# Altium project DualMetroPrototyp.PrjPcb
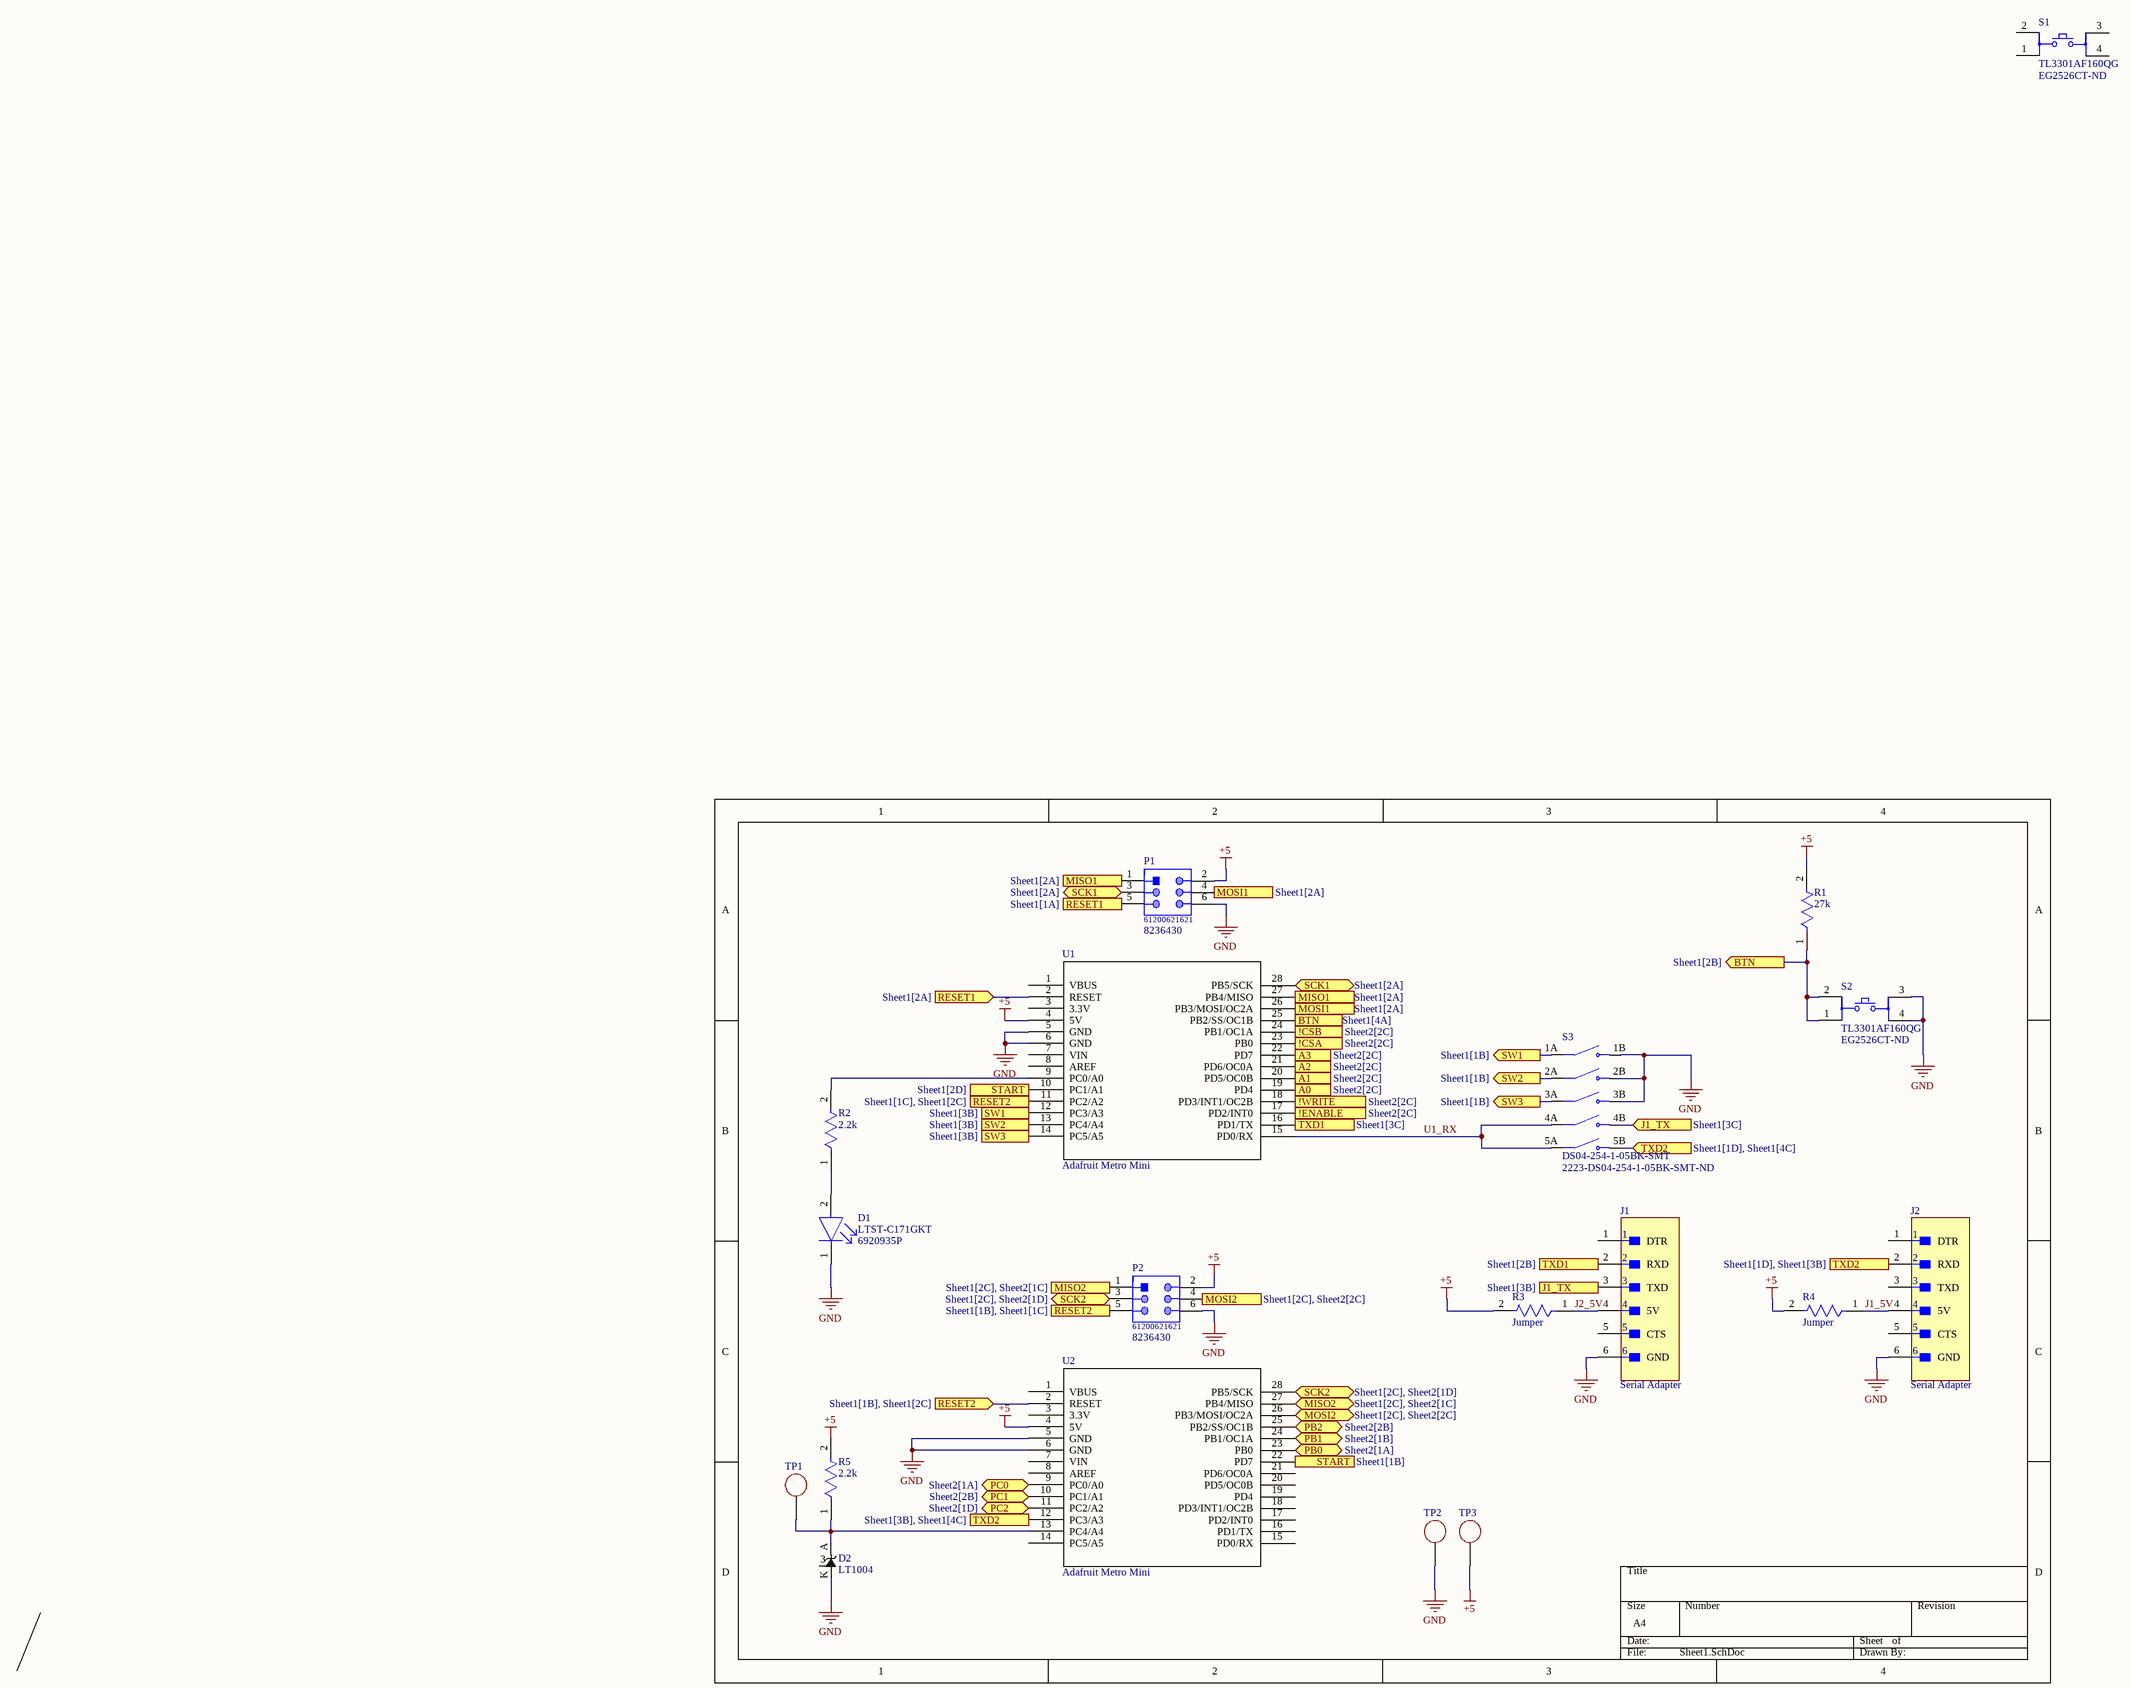
[diagram p0: Sheet1.SchDoc]
2 sheets, 28 parts. Net scope: flat (ports and power ports of the same name join across sheets).
Board file: DualMetroPrototyp.PcbDoc
Sheets:
  Sheet1.SchDoc
  Sheet2.SchDoc

## Sheet Sheet1.SchDoc
size A4; SheetNumber: 1; SheetTotal: 2

### Parts
D1  LTST-C171GKT  Supplier Part Number 1: 6920935P  [FP-LTST-C171GKT-MFG]
D2  LT1004  [LT1004CZ]  (no BOM)
J1  Serial Adapter  [FP-22-28-4060-MFG]
J2  Serial Adapter  [FP-22-28-4060-MFG]
P1  61200621621  Supplier Part Number 1: 8236430  [61200621621]
P2  61200621621  Supplier Part Number 1: 8236430  [61200621621]
R1  27k  [FP-RMCF0805-IPC_B]
R2  2.2k  [FP-RMCF0805-IPC_B]
R3  Jumper  [FP-RMCF0805-IPC_B]  (no BOM)
R4  Jumper  [FP-RMCF0805-IPC_B]  (no BOM)
R5  2.2k  [FP-RMCF0805-IPC_B]
S1  TL3301AF160QG  Supplier Part Number 1: EG2526CT-ND  [FP-TL3301AF160QG-MFG]
S2  TL3301AF160QG  Supplier Part Number 1: EG2526CT-ND  [FP-TL3301AF160QG-MFG]
S3  DS04-254-1-05BK-SMT  Supplier Part Number 1: 2223-DS04-254-1-05BK-SMT-ND  [SW_DS04-254-1-05BK-SMT]
TP1  61300111121  [61300111121]  (value not drawn)  (no BOM)
TP2  61300111121  [61300111121]  (value not drawn)  (no BOM)
TP3  61300111121  [61300111121]  (value not drawn)  (no BOM)
U1  Adafruit Metro Mini  [Adafruit Metro Mini]  (no BOM)
U2  Adafruit Metro Mini  [Adafruit Metro Mini]  (no BOM)

### Ports
!CSA (out, see Sheet2[2C]), !CSB (out, see Sheet2[2C]), !ENABLE (out, see Sheet2[2C]), !WRITE (out, see Sheet2[2C]), A0 (out, see Sheet2[2C]), A1 (out, see Sheet2[2C]), A2 (out, see Sheet2[2C]), A3 (out, see Sheet2[2C]), BTN (in, see Sheet1[4A]), BTN (out, see Sheet1[2B]), J1_TX (in, see Sheet1[3C]), J1_TX (out, see Sheet1[3B]), MISO1 (in, see Sheet1[2A]), MISO1 (out, see Sheet1[2A]), MISO2 (bidir, see Sheet1[2C], Sheet2[1C]), MISO2 (in, see Sheet1[2C], Sheet2[1C]), MOSI1 (in, see Sheet1[2A]), MOSI1 (out, see Sheet1[2A]), MOSI2 (bidir, see Sheet1[2C], Sheet2[2C]), MOSI2 (out, see Sheet1[2C], Sheet2[2C]), PB0 (bidir, see Sheet2[1A]), PB1 (bidir, see Sheet2[1B]), PB2 (bidir, see Sheet2[2B]), PC0 (bidir, see Sheet2[1A]), PC1 (bidir, see Sheet2[2B]), PC2 (bidir, see Sheet2[1D]), RESET1 (in, see Sheet1[2A]), RESET1 (out, see Sheet1[1A]), RESET2 (in, see Sheet1[1B], Sheet1[2C]), RESET2 (out, see Sheet1[1B], Sheet1[1C]), RESET2 (out, see Sheet1[1C], Sheet1[2C]), SCK1 (bidir, see Sheet1[2A]), SCK2 (bidir, see Sheet1[2C], Sheet2[1D]), START (in, see Sheet1[1B]), START (out, see Sheet1[2D]), SW1 (in, see Sheet1[3B]), SW1 (out, see Sheet1[1B]), SW2 (in, see Sheet1[3B]), SW2 (out, see Sheet1[1B]), SW3 (in, see Sheet1[3B]), SW3 (out, see Sheet1[1B]), TXD1 (in, see Sheet1[2B]), TXD1 (out, see Sheet1[3C]), TXD2 (in, see Sheet1[1D], Sheet1[3B]), TXD2 (in, see Sheet1[1D], Sheet1[4C]), TXD2 (out, see Sheet1[3B], Sheet1[4C])

### Nets
+5: P1.2(5V) P2.2(5V) R1.2 R3.2 R4.2 R5.2 TP3.1 U1.4(5V) U2.4(5V)
GND: D1.1(C) D2.K(Kathode) J1.6(GND) J2.6(GND) P1.6(GND) P2.6(GND) S2.3 S2.4 S3.1B(NO1) S3.2B(NO2) S3.3B(NO3) TP2.1 U1.5(GND) U1.6(GND) U2.5(GND) U2.6(GND)
!CSA: U1.23(PB0) ; port !CSA
!CSB: U1.24(PB1/OC1A) ; port !CSB
!ENABLE: U1.17(PD2/INT0) ; port !ENABLE
!WRITE: U1.18(PD3/INT1/OC2B) ; port !WRITE
A0: U1.19(PD4) ; port A0
A1: U1.20(PD5/OC0B) ; port A1
A2: U1.21(PD6/OC0A) ; port A2
A3: U1.22(PD7) ; port A3
BTN: R1.1 S2.1 S2.2 U1.25(PB2/SS/OC1B) ; port BTN
J1_5V: J2.4(5V) R4.1
J1_TX: J1.3(TXD) S3.4B(NO4) ; port J1_TX
J2_5V: J1.4(5V) R3.1
MISO1: P1.1(MISO) U1.27(PB4/MISO) ; port MISO1
MISO2: P2.1(MISO) U2.27(PB4/MISO) ; port MISO2
MOSI1: P1.4(MOSI) U1.26(PB3/MOSI/OC2A) ; port MOSI1
MOSI2: P2.4(MOSI) U2.26(PB3/MOSI/OC2A) ; port MOSI2
PB0: U2.23(PB0) ; port PB0
PB1: U2.24(PB1/OC1A) ; port PB1
PB2: U2.25(PB2/SS/OC1B) ; port PB2
Probe1: U2.9(PC0/A0) ; port PC0
Probe2: U2.10(PC1/A1) ; port PC1
Probe3: U2.11(PC2/A2) ; port PC2
RESET1: P1.5(RESET) U1.2(RESET) ; port RESET1
RESET2: P2.5(RESET) U1.11(PC2/A2) U2.2(RESET) ; port RESET2
SCK1: P1.3(SCK) U1.28(PB5/SCK) ; port SCK1
SCK2: P2.3(SCK) U2.28(PB5/SCK) ; port SCK2
START: U1.10(PC1/A1) U2.22(PD7) ; port START
SW1: S3.1A(COM1) U1.12(PC3/A3) ; port SW1
SW2: S3.2A(COM2) U1.13(PC4/A4) ; port SW2
SW3: S3.3A(COM3) U1.14(PC5/A5) ; port SW3
TXD1: J1.2(RXD) U1.16(PD1/TX) ; port TXD1
TXD2: J2.2(RXD) S3.5B(NO5) U2.12(PC3/A3) ; port TXD2
U1_RX: S3.4A(COM4) S3.5A(COM5) U1.15(PD0/RX)
NetD1_2: D1.2(A) R2.1
NetD2_A: D2.A(Anode) R5.1 TP1.1 U2.13(PC4/A4)
NetR2_2: R2.2 U1.9(PC0/A0)

Not connected (* = marked no-connect by the designer): D2 3; J1 1(DTR) 5(CTS); J2 1(DTR) 3(TXD) 5(CTS); S1 1 2 3 4; U1 1(VBUS) 3(3.3V) 7(VIN) 8(AREF); U2 1(VBUS) 3(3.3V) 7(VIN) 8(AREF) 14(PC5/A5) 15(PD0/RX) 16(PD1/TX) 17(PD2/INT0) 18(PD3/INT1/OC2B) 19(PD4) 20(PD5/OC0B) 21(PD6/OC0A)

### Library data of the parts
D1 = CMP-22017-000007-1: LED GREEN CLEAR CHIP SMD; Luminous Intensity: 12mcd; Lens Color: Colorless; Dominant Wavelength: 569nm; Number of LEDs: 1; Power Dissipation: 100mW; Viewing Angle: 130°; Reverse Voltage: 5V; Test Current: 10mA; Forward Voltage: 2.1V; Wavelength: 585nm; Lens Style: Diffused; Forward Current: 30mA; Height: 0.8mm; Mount: Surface Mount; Package Quantity: 1; Length: 2mm; Case Code (Metric): 2012; Number of Pins: 2; Number of Elements: 1; Packaging: Tape and Reel; Color: Green; Min Operating Temperature: -55°C; Case/Package: 0805; Power Rating: 100mW; Max Operating Temperature: 85°C; Radiation Hardening: No; Depth: 1.25mm; Lens Transparency: Clear; Width: 1.25mm; Lead Free: Lead Free; Case Code (Imperial): 0805; Illumination Color: Green; Supplier 1: Rs
D2 = LT1004: pin to pad: 3>1 Â1>2
J1 J2 = CMP-04776-000763-1: CONN HEADER VERT 6POS 2.54MM; Voltage Rating: 250V; Current Rating: 4A; Number of Contacts: 6; Max Voltage Rating (DC): 250.25kV; Gender: Male; Contact Resistance: 20mR; Connector Type: Male Pin; Color: Black; Max Voltage Rating (AC): 250V; Pitch: 2.54mm; Orientation: Straight; Max Operating Temperature: 75°C; Contact Plating: Tin; Depth: 2.49mm; Contact Type: Male Pin; Number of Positions: 6; Length: 15.24mm; Packaging: Bulk; Mount: Through Hole; Housing Material: Thermoplastic; Housing Color: Black; Termination: Solder; Contact Material: Brass; Min Operating Temperature: 0°C; Series: KK® 42375; Number of Rows: 1; Package Quantity: 1; RoHS Compliant: Yes; Contact Mating Length: 0.24inch
P1 P2 = CMP-1502-00000-1: Male Box Header WR-BHD, THT, Vertical, pitch 2.54 mm, 6 pins; Manufacturer: Wurth Elektronik; Withstanding Voltage: 500VAC; Working Voltage: 250VAC; Pin Number: 6; Pitch: 2.54mm; Contact Resistance: 20mOhm; Part Number: 61200621621; Manufacturer URL: http://www.we-online.de; Published Date: August2018; Orientation: Vertical; Publisher: WurthElektronik; Operating Temperature: -40to125degC; Datasheet URL: https://katalog.we-online.de/em/datasheet/6120xx21621.pdf; Mounting Technology: THT; Packaging: Tray; Gender: Male; Package Reference: 61200621621; Supplier 1: Rs
R1-R5 = CMP-26527-000017-1: RES 0 OHM JUMPER 1/8W 0805; Power Rating: 125mW; Resistance: 0mR; Depth: 1.25mm; Length: 2mm; Military Standard: Not; Width: 0.049inch; Case Code (Imperial): 0805; Number of Terminations: 2; Mount: Surface Mount; Contact Plating: Tin; Height: 0.026inch; Case/Package: 0805; Min Operating Temperature: -55°C; Composition: Thick Film; Max Operating Temperature: 155°C; Packaging: Tape and Reel; Features: Automotive AEC-Q200; Max Power Dissipation: 125mW; Radiation Hardening: No; Lead Free: Lead Free; Case Code (Metric): 2012
S1 S2 = TL3301AF160QG: Keypad Switch, 1 Switches, SPST, Momentary-tactile, 0.05A, 50VDC, 2.06N, Solder Terminal, Surface Mount-straight12V; Actuator Type: Standard; Current Rating: 50mA; Contact Resistance: 100mR; Max Voltage Rating (DC): 50V; Voltage Rating (DC): 12V; Actuator Length: 1.4mm; Electrical Life: 100000Cycles; Switch Travel: 0.25mm; Operating Force: 160gf; Switch Function: Off-Mom; Actuator Material: Nylon; Illumination Type: Non-Illuminated; Orientation: Straight; Lead Free: Lead Free; Contact Material: Silver; Series: TL3301; Mount: Surface Mount; Voltage Rating: 50V; REACH SVHC: No SVHC; Packaging: Tape and Reel; Termination: Gull Wing; RoHS Compliant: Yes; Throw Configuration: SPST; Min Operating Temperature: -20°C; Package Quantity: 1000; Mechanical Life: 100000Cycles; Contact Plating: Silver; Max Operating Temperature: 70°C; Insulation Resistance: 100MR; Supplier 1: Digi-Key
TP1-TP3 = Testpoint: THT Vertical Pin Header WR-PHD, Pitch 2.54 mm, Single Row, 1 pins; Manufacturer: Wurth Elektronik; Gender: Male; Working Voltage: 250VAC; Withstanding Voltage: 500VAC; Pin Number: 1; Contact Resistance: 20mOhm; Rated Current: 3A; Pitch: 2.54mm; Mounting Technology: THT; Datasheet URL: https://katalog.we-online.de/em/datasheet/6130xx11121.pdf; Manufacturer URL: http://www.we-online.de; Operating Temperature: -40to105degC; Publisher: WurthElektronik; Part Number: 61300111121; Row Number: Single; Package Reference: 61300111121; Orientation: Vertical; Packaging: Bag
S3 = DS04-254-1-05BK-SMT: Availability: Unavailable; Price: None; Package: None; Value: *; MP: DS04-254-1-05BK-SMT; Supplier 1: Digi-Key

## Sheet Sheet2.SchDoc
size A4; SheetNumber: 2; SheetTotal: 2
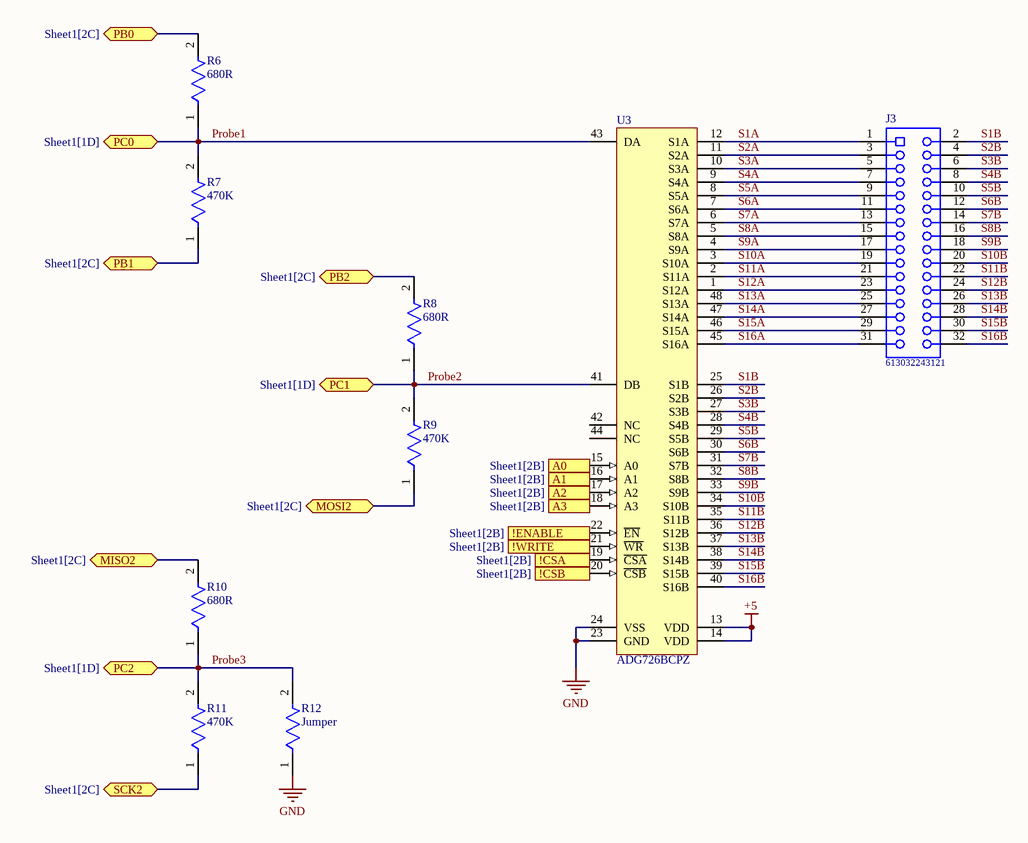
[diagram p1: Sheet2.SchDoc]

### Parts
J3  613032243121  [613032243121]
R6  680R  [FP-RMCF0805-IPC_B]  (no BOM)
R7  470K  [FP-RMCF0805-IPC_B]  (no BOM)
R8  680R  [FP-RMCF0805-IPC_B]  (no BOM)
R9  470K  [FP-RMCF0805-IPC_B]  (no BOM)
R10  680R  [FP-RMCF0805-IPC_B]  (no BOM)
R11  470K  [FP-RMCF0805-IPC_B]  (no BOM)
R12  Jumper  [FP-RMCF0805-IPC_B]  (no BOM)
U3  ADG726BCPZ  [ADG726 Breakout]  (no BOM)

### Ports
!CSA (in, see Sheet1[2B]), !CSB (in, see Sheet1[2B]), !ENABLE (in, see Sheet1[2B]), !WRITE (in, see Sheet1[2B]), A0 (in, see Sheet1[2B]), A1 (in, see Sheet1[2B]), A2 (in, see Sheet1[2B]), A3 (in, see Sheet1[2B]), MISO2 (bidir, see Sheet1[2C]), MOSI2 (bidir, see Sheet1[2C]), PB0 (bidir, see Sheet1[2C]), PB1 (bidir, see Sheet1[2C]), PB2 (bidir, see Sheet1[2C]), PC0 (bidir, see Sheet1[1D]), PC1 (bidir, see Sheet1[1D]), PC2 (bidir, see Sheet1[1D]), SCK2 (bidir, see Sheet1[2C])

### Nets
+5: U3.13(VDD) U3.14(VDD)
GND: R12.1 U3.23(GND) U3.24(VSS)
!CSA: U3.19(~{CSA}) ; port !CSA
!CSB: U3.20(~{CSB}) ; port !CSB
!ENABLE: U3.22(~{EN}) ; port !ENABLE
!WRITE: U3.21(~{WR}) ; port !WRITE
A0: U3.15(A0) ; port A0
A1: U3.16(A1) ; port A1
A2: U3.17(A2) ; port A2
A3: U3.18(A3) ; port A3
MISO2: R10.2 ; port MISO2
MOSI2: R9.1 ; port MOSI2
PB0: R6.2 ; port PB0
PB1: R7.1 ; port PB1
PB2: R8.2 ; port PB2
Probe1: R6.1 R7.2 U3.43(DA) ; port PC0
Probe2: R8.1 R9.2 U3.41(DB) ; port PC1
Probe3: R10.1 R11.2 R12.2 ; port PC2
S1A: J3.1 U3.12(S1A)
S1B: J3.2 U3.25(S1B)
S2A: J3.3 U3.11(S2A)
S2B: J3.4 U3.26(S2B)
S3A: J3.5 U3.10(S3A)
S3B: J3.6 U3.27(S3B)
S4A: J3.7 U3.9(S4A)
S4B: J3.8 U3.28(S4B)
S5A: J3.9 U3.8(S5A)
S5B: J3.10 U3.29(S5B)
S6A: J3.11 U3.7(S6A)
S6B: J3.12 U3.30(S6B)
S7A: J3.13 U3.6(S7A)
S7B: J3.14 U3.31(S7B)
S8A: J3.15 U3.5(S8A)
S8B: J3.16 U3.32(S8B)
S9A: J3.17 U3.4(S9A)
S9B: J3.18 U3.33(S9B)
S10A: J3.19 U3.3(S10A)
S10B: J3.20 U3.34(S10B)
S11A: J3.21 U3.2(S11A)
S11B: J3.22 U3.35(S11B)
S12A: J3.23 U3.1(S12A)
S12B: J3.24 U3.36(S12B)
S13A: J3.25 U3.48(S13A)
S13B: J3.26 U3.37(S13B)
S14A: J3.27 U3.47(S14A)
S14B: J3.28 U3.38(S14B)
S15A: J3.29 U3.46(S15A)
S15B: J3.30 U3.39(S15B)
S16A: J3.31 U3.45(S16A)
S16B: J3.32 U3.40(S16B)
SCK2: R11.1 ; port SCK2

Not connected (* = marked no-connect by the designer): U3 42(NC) 44(NC)

### Library data of the parts
J3 = CMP-1502-01445-1: THT Angled Socket Header WR-PHD, Pitch 2.54 mm, Dual Row, 32 pins; Manufacturer: Wurth Elektronik; Pitch: 2.54mm; Contact Resistance: 20mOhm; Gender: Female; Withstanding Voltage: 500VAC; Rated Current: 3A; Working Voltage: 250VAC; Pin Number: 32; Publisher: WurthElektronik; Part Number: 613032243121; Manufacturer URL: http://www.we-online.de; Package Reference: 613032243121; Operating Temperature: -40to125degC; Mounting Technology: THT; Packaging: Tray; Datasheet URL: https://katalog.we-online.de/em/datasheet/6130xx243121.pdf; Row Number: Dual; Orientation: Angled
R6-R12 = CMP-26527-000017-1: as R1 on sheet Sheet1; Depth: 1.25mm; Length: 2mm; Military Standard: Not; Width: 0.049inch; Case Code (Imperial): 0805; Number of Terminations: 2; Mount: Surface Mount; Contact Plating: Tin; Height: 0.026inch; Case/Package: 0805; Min Operating Temperature: -55°C; Composition: Thick Film; Max Operating Temperature: 155°C; Packaging: Tape and Reel; Features: Automotive AEC-Q200; Max Power Dissipation: 125mW; Radiation Hardening: No; Lead Free: Lead Free; Case Code (Metric): 2012
U3 = CMP-0798-00018-1: 1.8 to 5.5 V / +/-2.5 V, 4 Ohm, 16-Channel Analog Multiplexer, -40 to 85 degC, 48-pin QFN (CP-48-1), Tray; Manufacturer: Analog Devices; Ron (ohms): 4; Supply V Guar Performance: Dual_(+/-2.5V), Single_(+3V), Single_(+5V); Bandwidth (Hz): 34M; Max Analog Signal Range: Vss to Vdd; t transition (s): 23n; PackageDescription: 48-Pin Lead Frame Chip Scale Package, Body 7 x 7 mm, Pitch 0.5 mm; ComponentLink3URL: http:/www.analog.com/static/imported-files/packages/PKG_PDF/LFCSP(CP)/CP-48/CP_48_1.pdf; Code_JEDEC: MO-220-VKKD-2; ComponentLink2Description: Datasheet; PackageReference: CP-48-1; ComponentLink2URL: http://www.analog.com/static/imported-files/data_sheets/ADG726_732.pdf; DatasheetVersion: Rev. 0; PartNumber: ADG726BCPZ; ComponentLink3Description: Package Specification; Packing: Tray; ComponentLink1URL: http://www.analog.com/en/index.html; ComponentLink1Description: Manufacturer URL; Mounting Technology: Surface Mount

## Nets that join several sheets
+5: Sheet1 (9 pins), Sheet2 (U3.13 U3.14)
GND: Sheet1 (16 pins), Sheet2 (R12.1 U3.23 U3.24)
!CSA: Sheet1 (U1.23), Sheet2 (U3.19)
!CSB: Sheet1 (U1.24), Sheet2 (U3.20)
!ENABLE: Sheet1 (U1.17), Sheet2 (U3.22)
!WRITE: Sheet1 (U1.18), Sheet2 (U3.21)
A0: Sheet1 (U1.19), Sheet2 (U3.15)
A1: Sheet1 (U1.20), Sheet2 (U3.16)
A2: Sheet1 (U1.21), Sheet2 (U3.17)
A3: Sheet1 (U1.22), Sheet2 (U3.18)
MISO2: Sheet1 (P2.1 U2.27), Sheet2 (R10.2)
MOSI2: Sheet1 (P2.4 U2.26), Sheet2 (R9.1)
PB0: Sheet1 (U2.23), Sheet2 (R6.2)
PB1: Sheet1 (U2.24), Sheet2 (R7.1)
PB2: Sheet1 (U2.25), Sheet2 (R8.2)
Probe1: Sheet1 (U2.9), Sheet2 (R6.1 R7.2 U3.43)
Probe2: Sheet1 (U2.10), Sheet2 (R8.1 R9.2 U3.41)
Probe3: Sheet1 (U2.11), Sheet2 (R10.1 R11.2 R12.2)
SCK2: Sheet1 (P2.3 U2.28), Sheet2 (R11.1)